# EAGLE design BSPD (EAGLE 9.6.2)
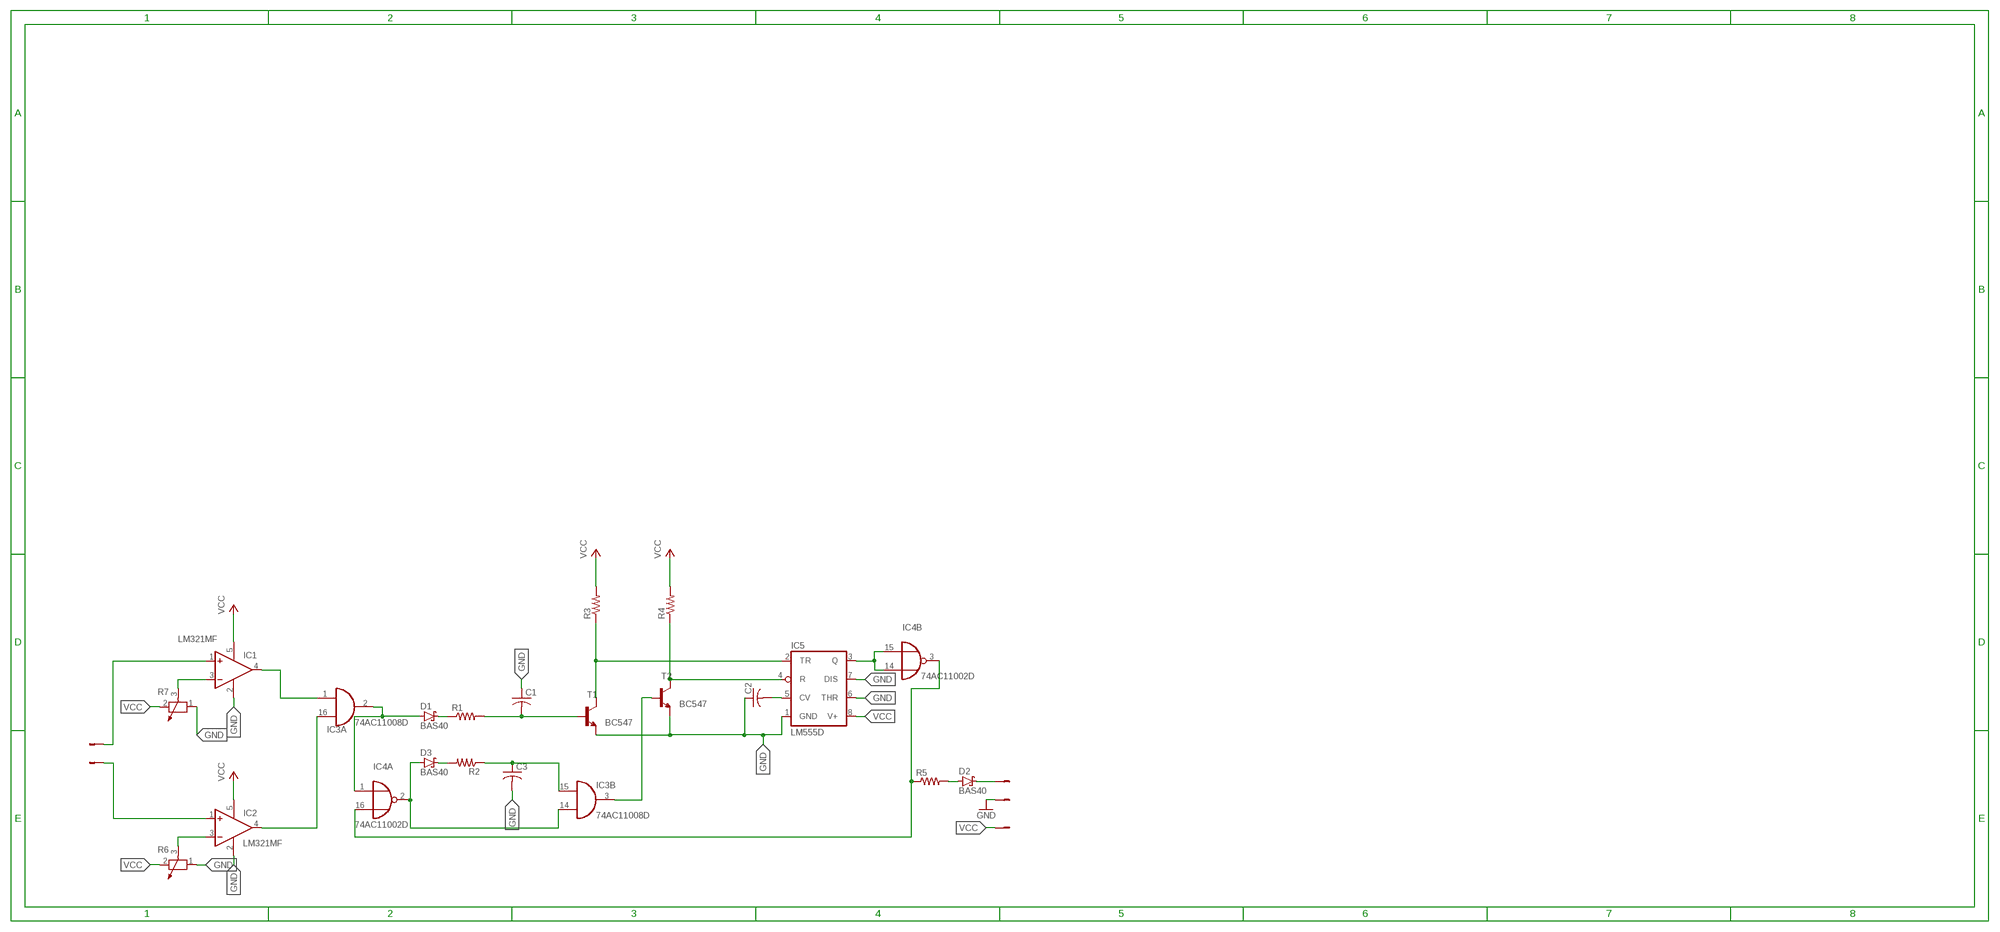
[diagram p0: schematic, sheet 1]

## Parts
C1  C-USC0402  [C0402]
C2  C-USC0402  [C0402]
C3  C-USC0402  [C0402]
D1  BAS40  [SOT23]
D2  BAS40  [SOT23]
D3  BAS40  [SOT23]
IC1  LM321MF  [SOT23-5]
IC2  LM321MF  [SOT23-5]
IC3  74AC11008D  [SO16]
IC4  74AC11002D  [SO16]
IC5  LM555D  [SO08]
R1  R-US_M1406  [M1406]
R2  R-US_M1406  [M1406]
R3  R-US_M1406  [M1406]
R4  R-US_M1406  [M1406]
R5  R-US_M1406  [M1406]
R6  POTENTIOMETER_PT-10  [PT-10]
R7  POTENTIOMETER_PT-10  [PT-10]
T1  BC547  [TO92]
T2  BC547  [TO92]
X1  22-23-2021  [22-23-2021]
X2  22-23-2021  [22-23-2021]
X3  22-23-2021  [22-23-2021]

## Nets
GND: C1.1 C2.1 C3.2 IC1.2(V-) IC2.2(V-) IC5.1(GND) IC5.6(THR) IC5.7(DIS) R6.1 R7.1 T1.1(E) T2.1(E) X2.1
N$1: IC1.1(+IN) X1.1
N$2: IC2.1(+IN) X1.2
N$3: IC1.3(-IN) R7.3
N$4: IC2.3(-IN) R6.3
N$5: IC1.4(OUT) IC3.1(A:I0)
N$6: IC2.4(OUT) IC3.16(A:I1)
N$7: D1.1(A) IC3.2(A:O) IC4.1(A:I0)
N$8: IC4.3(B:O) IC4.16(A:I1) R5.1
N$9: D1.3(C) R1.1
N$10: D3.1(A) IC3.14(B:I1) IC4.2(A:O)
N$11: D3.3(C) R2.2
N$12: C3.1 IC3.15(B:I0) R2.1
N$13: C1.2 R1.2 T1.2(B)
N$14: IC5.2(TR) R3.1 T1.3(C)
N$15: IC5.4(R) R4.1 T2.3(C)
N$17: D2.1(A) R5.2
N$18: IC3.3(B:O) T2.2(B)
N$19: C2.2 IC5.5(CV)
N$20: IC4.14(B:I1) IC4.15(B:I0) IC5.3(Q)
N$21: D2.3(C) X2.2
VCC: IC1.5(V+) IC2.5(V+) IC5.8(V+) R3.2 R4.2 R6.2 R7.2 X3.1
Unconnected: IC3.6(C:O) IC3.7(D:O) IC3.8(D:I1) IC3.9(D:I0) IC3.10(C:I1) IC3.11(C:I0) IC4.6(C:O) IC4.7(D:O) IC4.8(D:I1) IC4.9(D:I0) IC4.10(C:I1) IC4.11(C:I0) X3.2

## Power pins joined to a net without a drawn wire
GND: IC3.4(P:GND) IC3.5(P:GND) IC4.4(P:GND) IC4.5(P:GND)
VCC: IC3.12(P:VCC) IC3.13(P:VCC) IC4.12(P:VCC) IC4.13(P:VCC)

## Library data of the parts
C1-C3 = adafruit:C-US: CAPACITOR, American symbol
D1-D3 = diode:BAS40: Silicon Schottky Diodes General-purpose diode for high-speed switching
IC1 IC2 = linear:LM321?*: Low Power Single Op Amp Source: http://cache.national.com/ds/LM/LM321.pdf
IC3 = 74ac-logic:74AC11008: Quadruple 2-input AND
IC4 = 74ac-logic:74AC11002: Quadruple 2-input NOR
IC5 = adafruit:*555: TIMER Changed DIP package to have round (not oval) pin pads http://www.ladyada.net/library/pcb/eaglelibrary.html
R1-R5 = adafruit:R-US_: RESISTOR, American symbol
R6 R7 = rcl:POTENTIOMETER_: Potentiometer; SPICEMODEL: POT; SPICEPREFIX: X
T1 T2 = transistor:BC547: NPN TRANSISTOR
X1-X3 = con-molex:22-23-2021: .100" (2.54mm) Center Header - 2 Pin; MF: MOLEX; MPN: 22-23-2021; OC_FARNELL: 1462926; OC_NEWARK: 25C3832

## Board
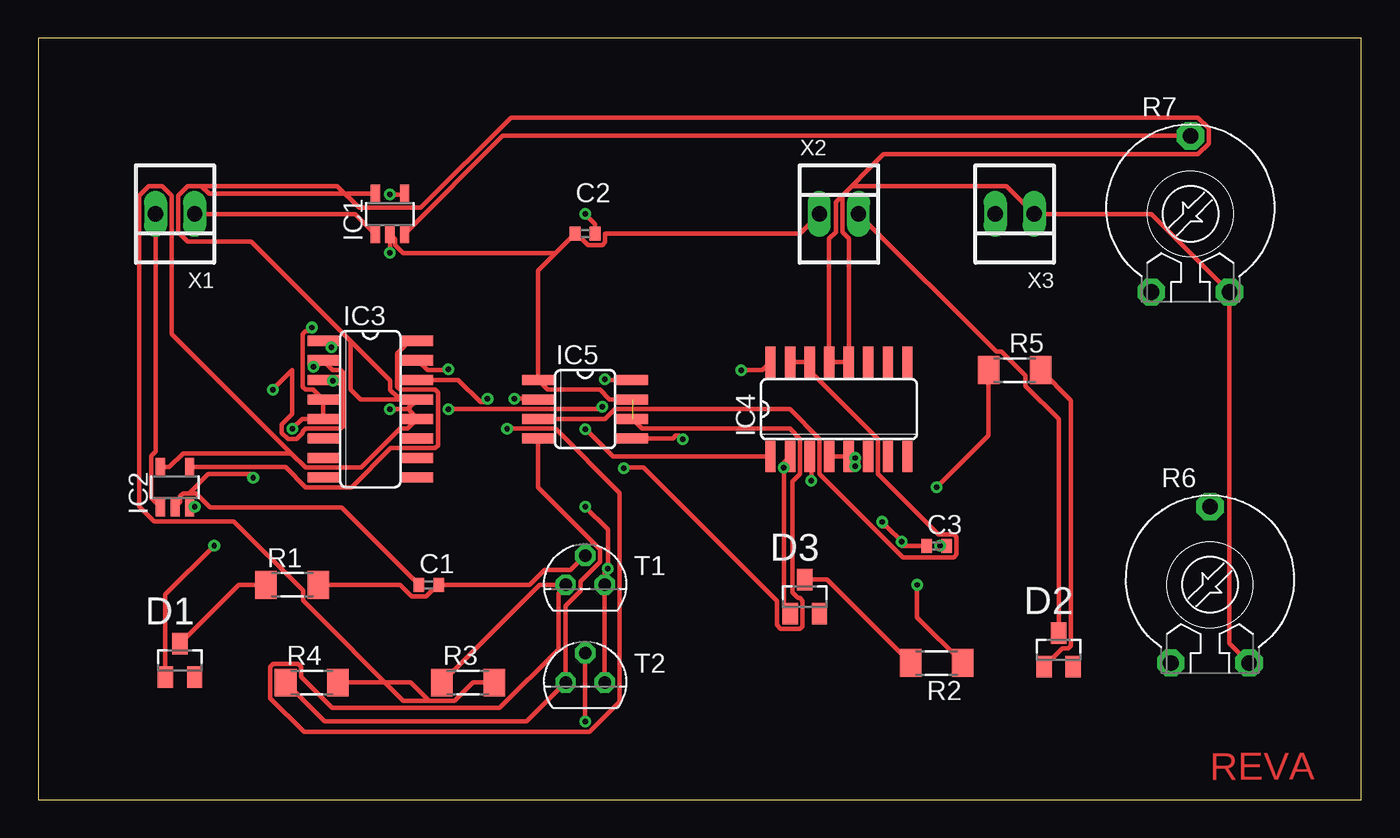
[diagram p1: board, top side]
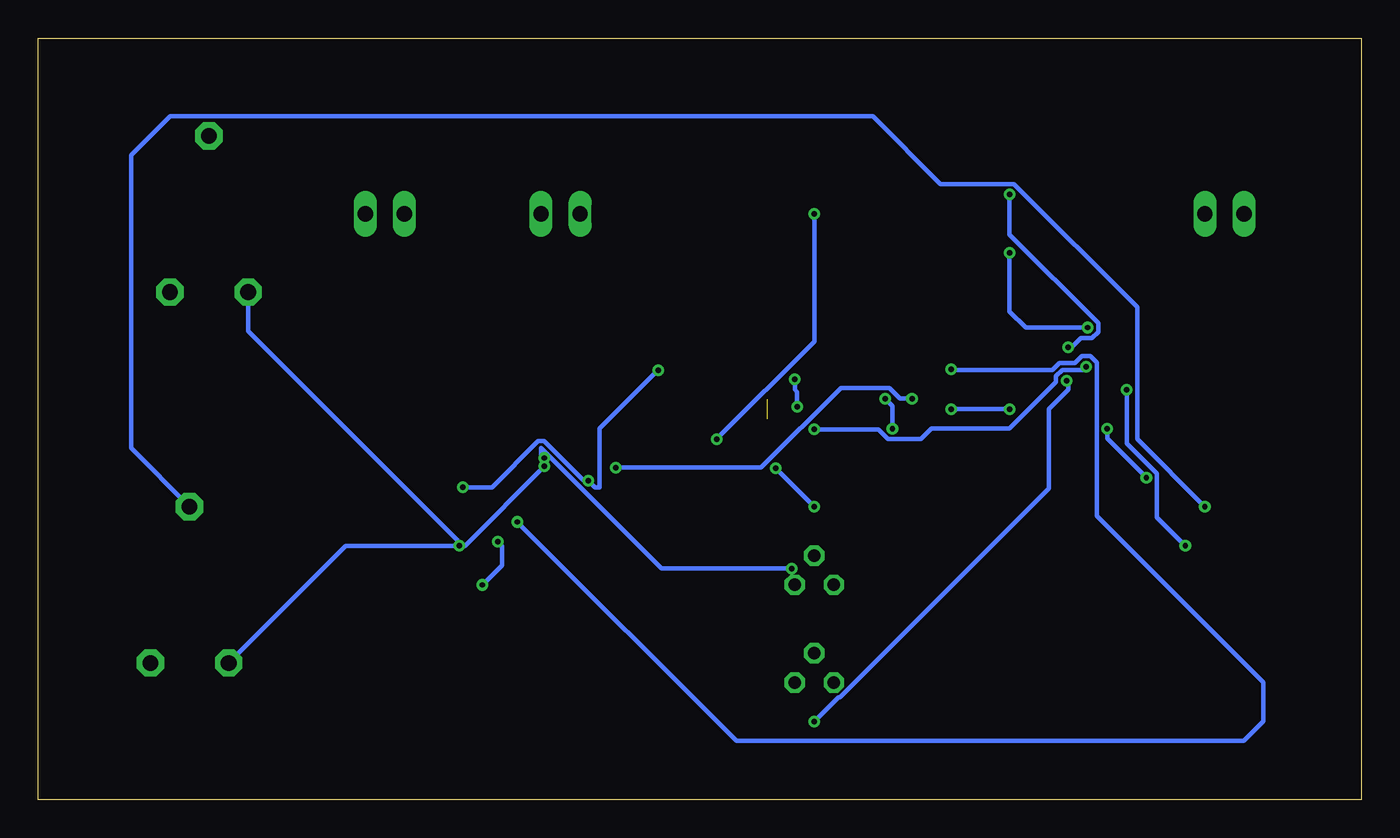
[diagram p2: board, bottom side, seen from below]

Size 86.03 x 49.52 mm. Coordinates in mm from the lower left corner, seen from the top.
Outline: 0,0 86.03,0 86.03,49.52 0,49.52 0,0
Copper layers (1*16): Top 0.035mm / dielectric 1.5mm / Bottom 0.035mm
Design rules "default": minimum track width 6mil, minimum drill 0.35mm, track to track 6mil, track to pad 6mil, pad to pad 6mil, via to via 6mil, smd to smd 6mil, copper to edge 40mil, drill to drill 6mil, minimum pad ring 10mil, minimum via ring 8mil, stop-mask expansion 4mil, vias tented up to drill 0mil, thermal gap 10mil

### Footprints (pad centres in the part's own frame; a part is rotated, then mirrored left to right if it is on the bottom)
C0402 = smd 0.7 x 0.9: 1 -0.65,0; 2 0.65,0
SOT23 = smd 1 x 1.4: 1 -0.95,-1.1; 2 0.95,-1.1; 3 0,1.1
SOT23-5 = smd 0.6 x 1.2: 1 -0.95,-1.306; 2 0,-1.306; 3 0.95,-1.306; 4 0.95,1.306; 5 -0.95,1.306
SO16 = smd 0.66 x 2.032: 1 -4.445,-3.073; 2 -3.175,-3.073; 3 -1.905,-3.073; 4 -0.635,-3.073; 5 0.635,-3.073; 6 1.905,-3.073; 7 3.175,-3.073; 8 4.445,-3.073; 9 4.445,3.073; 10 3.175,3.073; 11 1.905,3.073; 12 0.635,3.073; 13 -0.635,3.073; 14 -1.905,3.073; 15 -3.175,3.073; 16 -4.445,3.073
SO08 = smd 0.66 x 2.032: 1 -1.905,-3.073; 2 -0.635,-3.073; 3 0.635,-3.073; 4 1.905,-3.073; 5 1.905,3.073; 6 0.635,3.073; 7 -0.635,3.073; 8 -1.905,3.073
M1406 = smd 1.4 x 1.8: 1 -1.7,0; 2 1.7,0
PT-10 = drill 1.016 pad 1.778 octagon: 1 -2.54,-5.08; 2 2.54,-5.08; 3 0,5.08
TO92 = drill 0.813 octagon: 1 1.27,0; 2 0,1.905; 3 -1.27,0
22-23-2021 = drill 1 long: 1 -1.27,0; 2 1.27,0

### Placement (x,y rotation side)
C1  25.4,13.97 0 top
C2  35.56,36.83 0 top
C3  58.42,16.51 0 top
D1  9.21,9.06 0 top
D2  66.36,9.74 0 top
D3  49.85,13.21 0 top
IC1  22.86,38.1 0 top
IC2  8.89,20.32 0 top
IC3  21.59,25.4 270 top
IC4  52.07,25.4 0 top
IC5  35.56,25.4 270 top
R1  16.51,13.97 0 top
R2  58.42,8.89 180 top
R3  27.94,7.62 0 top
R4  17.78,7.62 0 top
R5  63.5,27.94 0 top
R6  76.2,13.97 0 top
R7  74.93,38.1 0 top
T1  35.56,13.97 0 top
T2  35.56,7.62 0 top
X1  8.89,38.1 180 top
X2  52.07,38.1 0 top
X3  63.5,38.1 180 top

### Tracks (layer width: path | path; a pad name or v marks a point on that pad's centre or on a via)
GND  (via drill 0.35)  (1 unrouted)
  Top 0.305: 33.64,35.56 C2.1 34.98,36.83 35.73,36.08 36.69,36.08 36.87,36.25 36.87,36.83 49.53,36.83 X2.1 | 33.64,35.56 23.71,35.56 23.2,36.07 23.2,36.45 IC1.2 v22.86,35.56 | 33.64,35.56 32.49,34.41 IC5.1 33.12,26.67 36.53,26.67 37.16,26.04 IC5.7 | C1.1 19.71,19.01 11.17,19.01 10.27,19.92 9.79,19.92 | IC2.2 9.23,19.36 9.23,19.74 9.41,19.92 9.79,19.92 | 9.79,19.92 11.04,21.17 13.97,21.17 v13.97,20.94 | v16.51,24.13 17.14,24.76 IC3.5 IC3.4 17.88,26.67 17.37,26.67 17.2,26.85 17.2,30.3 17.37,30.48 17.78,30.48 v17.78,30.71 | T2.1 T1.1 36.83,15.13 36.88,15.19 v37.04,15.03 37.04,17.57 v35.56,19.05 | v38.08,21.57 38.1,21.59 39.37,21.59 48.03,12.93 48.03,11.35 48.27,11.11 49.53,11.11 49.7,11.28 49.7,12.94 49.53,13.11 49.41,13.11 49.05,13.48 49.05,20.7 49.53,21.18 49.53,23.47 48.87,24.13 39.27,24.13 IC5.6 | v53.11,21.69 53.21,21.59 53.34,21.59 53.34,22 v53.11,22.22 52.81,22.22 IC4.5 IC4.4 | v58.65,16.51 C3.2
  Bottom 0.305: v13.97,20.94 16.51,23.48 v16.51,24.13 | v17.78,30.71 21.82,30.71 22.86,31.75 v22.86,35.56 | v37.04,15.03 45.51,15.03 53.34,22.86 53.34,22.45 v53.11,22.22 | v35.56,19.05 v38.08,21.57 38.1,21.59 | v53.11,21.69 58.29,16.51 58.42,16.51 | 58.42,16.51 v58.65,16.51 66.04,16.51 R6.1 | R7.1 72.39,30.48 58.42,16.51
N$1
  Top 0.305: X1.1 20.6,38.1 IC1.1
N$2
  Top 0.305: X1.2 7.62,22.64 7.33,22.35 7.33,19.62 IC2.1
N$3
  Top 0.305: IC1.3 30.2,43.18 R7.3
N$4  (via drill 0.35)
  Top 0.305: IC2.3 9.88,19.05 v10.16,19.05
  Bottom 0.305: v10.16,19.05 14.56,23.45 14.56,32.03 22.58,40.05 27.35,40.05 31.75,44.45 77.47,44.45 80.01,41.91 80.01,22.86 R6.3
N$5  (via drill 0.35)
  Top 0.305: IC1.4 23.77,39.37 v22.86,39.37 | v19.05,29.44 18.93,29.44 IC3.1
  Bottom 0.305: v22.86,39.37 22.86,36.75 17.1,30.99 17.1,30.42 17.5,30.02 18.24,30.02 19.05,29.21 v19.05,29.44
N$6
  Top 0.305: IC2.4 16.07,21.63 17.37,20.32 20.36,20.32 22.9,22.86 25.81,22.86 25.98,23.04 25.98,26.49 25.81,26.67 23.52,26.67 23.34,26.85 23.34,29.03 24.16,29.85 IC3.16
N$7  (via drill 0.35)
  Top 0.305: D1.1 8.26,13.34 v11.43,16.51 | v15.24,26.67 16.51,27.94 16.51,25.1 15.83,24.41 15.83,23.85 16.23,23.45 16.79,23.45 17.19,23.85 17.19,23.95 17.37,24.13 19.66,24.13 19.84,24.31 19.84,27.76 19.66,27.94 19.15,27.94 IC3.2 18.11,28.17 v17.88,28.17 | IC4.1 37.36,22.33 35.56,24.13 v35.56,24.08
  Bottom 0.305: v15.24,26.67 15.24,23.18 13.29,21.23 13.29,18.37 v11.43,16.51 | v35.56,24.08 31.4,24.08 30.76,23.45 28.62,23.45 27.94,24.13 22.86,24.13 19.84,27.15 19.84,27.54 19.44,27.94 17.78,27.94 17.78,28.07 v17.88,28.17
N$8  (via drill 0.35)
  Top 0.305: IC4.16 47.09,27.94 v45.72,27.94 | v50.27,20.75 50.27,22.22 IC4.3 | R5.1 61.8,23.7 v58.42,20.32
  Bottom 0.305: v45.72,27.94 49.53,24.13 49.53,20.32 49.83,20.32 v50.27,20.75 50.59,20.75 53.15,23.32 53.53,23.32 56.53,20.32 v58.42,20.32
N$9
  Top 0.305: D1.3 13.02,13.97 R1.1
N$10  (via drill 0.35)
  Top 0.305: IC3.14 27.3,27.3 28.75,25.86 29.21,25.86 v29.21,26.08 | IC4.2 48.49,21.92 v48.49,21.59 48.49,12.52 D3.1
  Bottom 0.305: v29.21,26.08 30,26.08 30.68,26.77 33.84,26.77 39.02,21.59 v48.49,21.59
N$11
  Top 0.305: R2.2 51.3,14.31 D3.3
N$12  (via drill 0.35)
  Top 0.305: R2.1 57.15,11.86 v57.15,13.97 | C3.1 56.12,16.51 56,16.63 v56.16,16.79 55.17,17.78 54.85,17.78 54.73,17.9 v54.89,18.06 | v26.67,27.99 26.62,27.94 25.3,27.94 IC3.15
  Bottom 0.305: v57.15,13.97 55.88,15.24 55.88,16.51 v56.16,16.79 | v54.89,18.06 40.64,3.81 7.62,3.81 6.35,5.08 6.35,7.62 17.2,18.47 17.2,28.45 17.6,28.85 18.16,28.85 18.61,28.4 19.63,28.4 20.08,27.94 26.67,27.94 v26.67,27.99
N$13
  Top 0.305: R1.2 23.52,13.97 24.27,13.21 25.23,13.21 25.98,13.97 C1.2 31.94,13.97 32.91,14.93 34.62,14.93 T1.2
N$14  (via drill 0.35)
  Top 0.305: R3.1 32.59,13.97 T1.3 34.29,13.89 33.83,13.43 33.83,9.78 30.01,5.96 19.11,5.96 17.09,7.98 17.09,8.65 16.91,8.82 15.25,8.82 15.07,8.65 15.07,6.59 17.27,4.4 35.84,4.4 37.8,6.35 37.8,19.96 33.63,24.13 v30.48,24.13 | v30.96,26.08 32.44,26.08 IC5.2
  Bottom 0.305: v30.96,26.08 30.48,25.6 v30.48,24.13
N$15
  Top 0.305: R4.1 18.62,5.08 31.75,5.08 T2.3 34.29,12.61 35.26,13.57 35.26,14.21 36.52,15.47 36.52,16.28 32.49,20.31 IC5.4
N$17
  Top 0.305: R5.2 67.17,25.97 67.17,10.01 66.99,9.83 66.61,9.83 D2.1
N$18  (via drill 0.35)
  Top 0.305: T2.2 v35.56,5.08 | v19.15,27.26 18.57,27.26 IC3.3
  Bottom 0.305: v35.56,5.08 33.98,6.65 33.89,6.65 20.32,20.22 20.32,25.4 19.05,26.67 19.05,27.15 v19.15,27.26
N$19  (via drill 0.35)
  Top 0.305: IC5.5 41.27,23.5 41.45,23.67 41.68,23.67 v41.91,23.45 | v35.56,38.1 36.21,37.45 C2.2
  Bottom 0.305: v41.91,23.45 35.56,29.8 v35.56,38.1
N$20
  Top 0.305: IC5.3 36.86,24.76 37.49,25.4 48.87,25.4 50.8,23.47 50.8,21.18 56.23,15.75 59.55,15.75 59.73,15.93 59.73,17.09 59.55,17.26 58.53,17.26 54.61,21.18 54.61,23.47 50.16,27.91 IC4.14 IC4.15
N$21
  Top 0.305: X2.2 62.3,29.14 62.63,29.14 64.19,27.58 64.19,26.91 66.36,24.75 D2.3
VCC  (via drill 0.35)
  Top 0.305: IC2.5 8.51,21.63 9.41,22.53 16.43,22.53 | IC1.5 11.11,39.41 10.6,39.91 | 20.32,29.82 13.85,36.29 9.72,36.29 9.1,36.91 9.1,39.29 9.72,39.91 10.6,39.91 | 20.32,29.82 20.32,26.67 20.95,26.04 24.13,26.04 | 24.13,26.04 IC3.13 | R4.2 24.21,7.62 25.41,6.42 | 25.41,6.42 27.07,6.42 28.27,7.62 R3.2 | 16.43,22.53 17.37,21.59 20.98,21.59 23.52,24.13 24.03,24.13 IC3.12 24.13,25.3 24.13,26.04 | 16.43,22.53 8.68,30.29 8.68,39.29 8.06,39.91 7.18,39.91 6.56,39.29 6.56,19.06 7.51,18.11 12.7,18.11 17.2,13.61 17.2,12.94 23.73,6.42 25.41,6.42 | IC3.13 24.03,25.4 v22.86,25.4 | v26.67,25.4 36.83,25.4 v36.68,25.55 | v36.83,27.35 36.88,27.3 IC5.8 | IC3.13 24.49,26.21 23.33,26.21 22.89,26.66 22.89,27.25 20.32,29.82 | 10.6,39.91 19.44,39.91 20.85,38.5 24.87,38.5 30.74,44.37 75.42,44.37 76.12,43.67 76.12,42.69 75.42,41.99 54.98,41.99 51.86,38.87 51.86,36.91 51.44,36.48 IC4.13 IC4.12 52.7,36.48 52.28,36.91 52.28,39.29 52.9,39.91 62.96,39.91 X3.1 72.39,38.1 R7.2 77.47,10.16 R6.2
  Bottom 0.305: v22.86,25.4 v26.67,25.4 | v36.68,25.55 36.68,26.52 36.83,26.67 v36.83,27.35

### Text on the board
Top: REVA